# EAGLE schematic prototype_total_schematic_n2 (EAGLE 8.4.1)

## Sheet 1 of 2: Peripherals
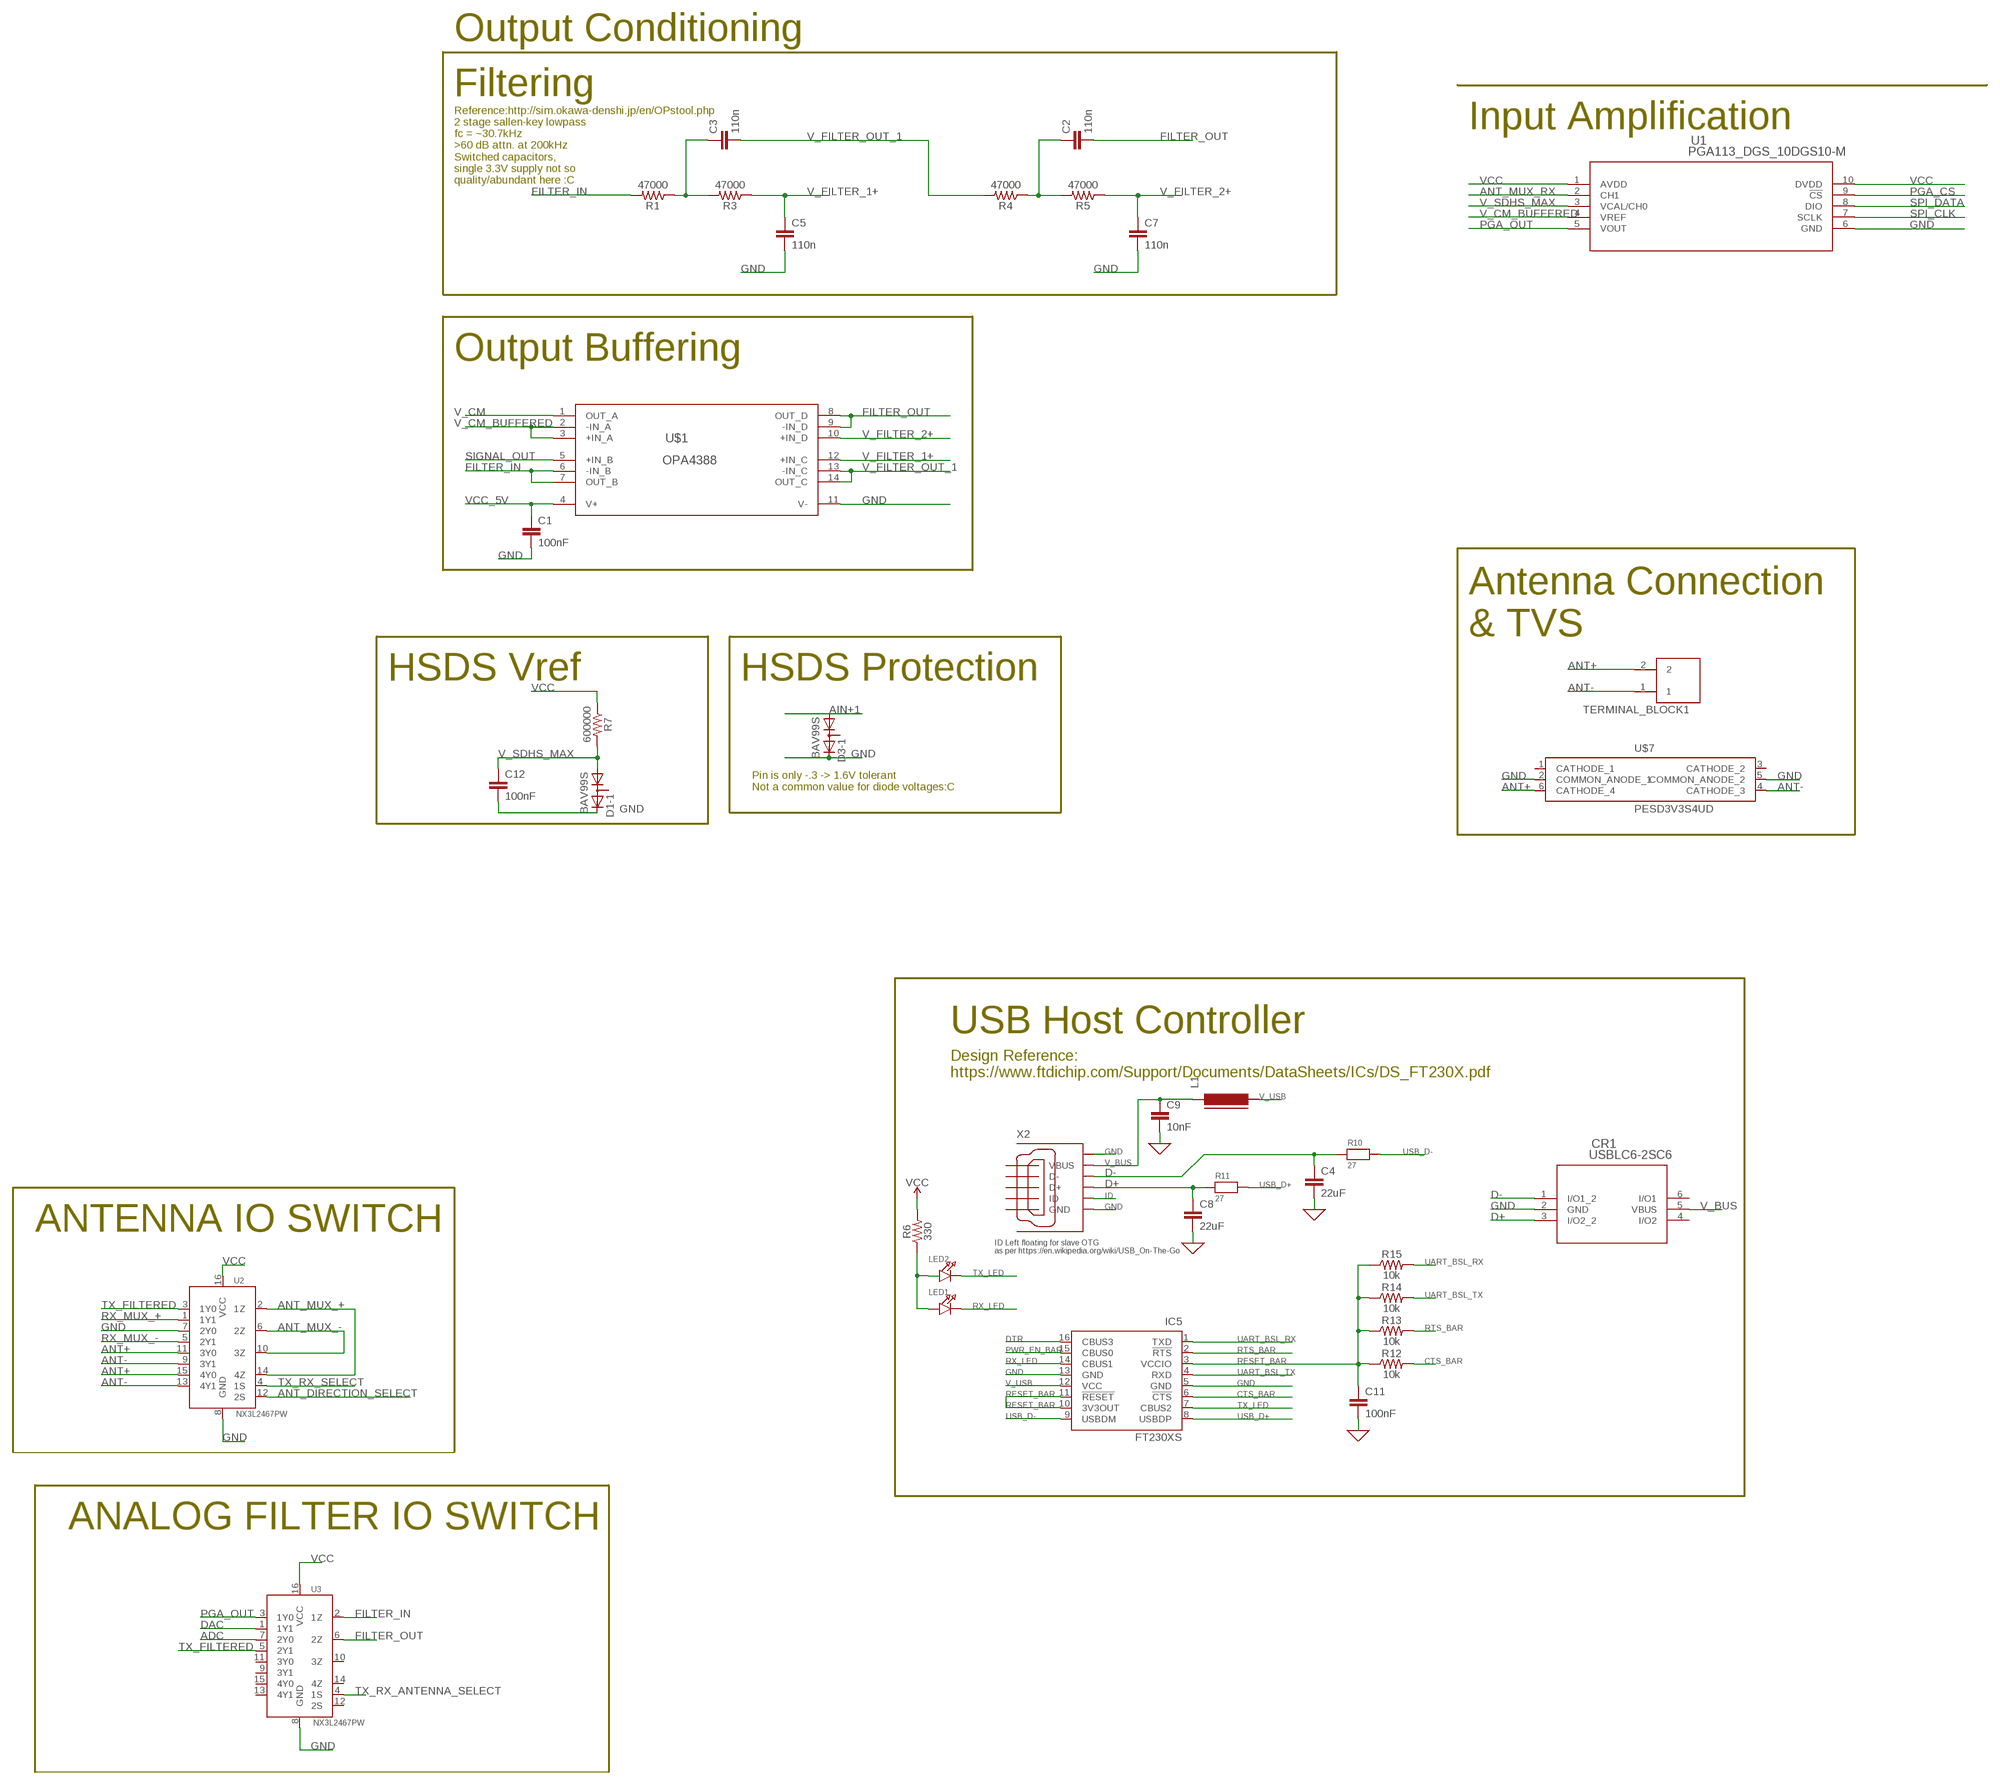
[diagram p0: schematic, sheet 1]

### Parts
C1  100nF  22UF-0805-6.3V-20%  [0805]
C2  110n  22UF-0805-6.3V-20%  [0805]
C3  110n  22UF-0805-6.3V-20%  [0805]
C4  22uF  22UF-0805-6.3V-20%  [0805]
C5  110n  22UF-0805-6.3V-20%  [0805]
C7  110n  22UF-0805-6.3V-20%  [0805]
C8  22uF  22UF-0805-6.3V-20%  [0805]
C9  10nF  22UF-0805-6.3V-20%  [0805]
C11  100nF  22UF-0805-6.3V-20%  [0805]
C12  100nF  22UF-0805-6.3V-20%  [0805]
CR1  USBLC6-2SC6  [SOT23-6L]
D1  BAV99S  [SOT363]
D3  BAV99S  [SOT363]
IC5  FT230XS  [SSOP16]
L1  FERRITE-0805  [FB805]
LED1  LED0805  [CHIPLED_0805]
LED2  LED0805  [CHIPLED_0805]
R1  47000  2.0KOHM-0603-1/10W-5%  [0603]
R3  47000  2.0KOHM-0603-1/10W-5%  [0603]
R4  47000  2.0KOHM-0603-1/10W-5%  [0603]
R5  47000  2.0KOHM-0603-1/10W-5%  [0603]
R6  330  2.0KOHM-0603-1/10W-5%  [0603]
R7  600000  2.0KOHM-0603-1/10W-5%  [0603]
R10  27  RESISTOR0805_NOTHERMALS  [0805_NOTHERMALS]
R11  27  RESISTOR0805_NOTHERMALS  [0805_NOTHERMALS]
R12  10k  2.0KOHM-0603-1/10W-5%  [0603]
R13  10k  2.0KOHM-0603-1/10W-5%  [0603]
R14  10k  2.0KOHM-0603-1/10W-5%  [0603]
R15  10k  2.0KOHM-0603-1/10W-5%  [0603]
TERMINAL_BLOCK1  ED555/2DS  [ED555/2DS]
U1  PGA113_DGS_10DGS10-M  [DGS10-M]
U2  NX3L2467PW  [SOT403-1]
U3  NX3L2467PW  [SOT403-1]
U$1  OPA4388  [TSSOP-14]
U$7  PESD3V3S4UD  [SOT23-6]
X2  GHI-CONNECTORS_10118192-0001LF  [GHI-CONNECTORS_10118192-0001LF(MICRO-USB-B-AMPHENOL-FCI)]

### Nets
0: C4.2 C8.2 C9.2 C11.2 ; supply symbol labelled GND
ADC: U3.7(2Y0)
ANT+: TERMINAL_BLOCK1.2 U2.11(3Y0) U2.15(4Y0) U$7.6(CATHODE_4)
ANT-: TERMINAL_BLOCK1.1 U2.9(3Y1) U2.13(4Y1) U$7.4(CATHODE_3)
ANT_DIRECTION_SELECT: U2.12(2S)
ANT_MUX_+: U2.2(1Z) U2.14(4Z)
ANT_MUX_-: U2.6(2Z) U2.10(3Z)
ANT_MUX_RX: U1.2(CH1)
CTS_BAR: IC5.6(!CTS) R12.2
D+: C8.1 CR1.3(I/O2_2) R11.1 X2.CGND3(SGND3)
D-: C4.1 CR1.1(I/O1_2) R10.1 X2.CGND4(SGND4)
DAC: U3.1(1Y1) ; also sheet 2
DTR: IC5.16(CBUS3) ; also sheet 2
FILTER_IN: R1.2 U3.2(1Z) U$1.6(-IN_B) U$1.7(OUT_B)
FILTER_OUT: C2.2 U3.6(2Z) U$1.8(OUT_D) U$1.9(-IN_D)
GND: C1.2 C5.2 C7.2 C12.2 CR1.2(GND) D1.2(-1:K2) D3.2(-1:K2) IC5.5(GND) IC5.13(GND) U1.6(GND) U2.7(2Y0) U2.8(GND) U3.8(GND) U$1.11(V-) U$7.2(COMMON_ANODE_1) U$7.5(COMMON_ANODE_2) X2.CGND1(SGND1) X2.CGND6(SGND6) ; also sheet 2
ID: X2.CGND2(SGND2)
N$3: LED1.A LED2.A R6.1
N$5: D3.1(-1:A1)
N$7: C3.1 R1.1 R3.2
N$9: C2.1 R4.1 R5.2
PGA_CS: U1.9(!CS)
PGA_OUT: U1.5(VOUT) U3.3(1Y0)
PWR_EN_BAR: IC5.15(CBUS0)
RESET_BAR: C11.1 IC5.3(VCCIO) IC5.10(3V3OUT) IC5.11(!RESET) R12.1 R13.1 R14.1 R15.1
RTS_BAR: IC5.2(!RTS) R13.2 ; also sheet 2
RX_LED: IC5.14(CBUS1) LED1.C ; also sheet 2
RX_MUX_+: U2.1(1Y1)
RX_MUX_-: U2.5(2Y1)
SIGNAL_OUT: U$1.5(+IN_B)
SPI_CLK: U1.7(SCLK)
SPI_DATA: U1.8(DIO)
TX_FILTERED: U2.3(1Y0) U3.5(2Y1)
TX_LED: IC5.7(CBUS2) LED2.C ; also sheet 2
TX_RX_ANTENNA_SELECT: U3.4(1S)
TX_RX_SELECT: U2.4(1S)
UART_BSL_RX: IC5.1(TXD) R15.2 ; also sheet 2
UART_BSL_TX: IC5.4(RXD) R14.2 ; also sheet 2
USB_D+: IC5.8(USBDP) R11.2
USB_D-: IC5.9(USBDM) R10.2
V_BUS: C9.1 CR1.5(VBUS) L1.1 X2.CGND5(SGND5)
V_CM: U$1.1(OUT_A) ; also sheet 2
V_CM_BUFFERED: U1.4(VREF) U$1.2(-IN_A) U$1.3(+IN_A)
V_FILTER_1+: C5.1 R3.1 U$1.12(+IN_C)
V_FILTER_2+: C7.1 R5.1 U$1.10(+IN_D)
V_FILTER_OUT_1: C3.2 R4.2 U$1.13(-IN_C) U$1.14(OUT_C)
V_SDHS_MAX: C12.1 D1.1(-1:A1) R7.2 U1.3(VCAL/CH0)
V_USB: IC5.12(VCC) L1.2
VCC: R6.2 R7.1 U1.1(AVDD) U1.10(DVDD) U2.16(VCC) U3.16(VCC) ; also sheet 2
VCC_5V: C1.1 U$1.4(V+)
Unconnected: CR1.4(I/O2) CR1.6(I/O1) D1.3(-2:K1A2) D1.4(-2:A1) D1.5(-2:K2) D1.6(-1:K1A2) D3.3(-2:K1A2) D3.4(-2:A1) D3.5(-2:K2) D3.6(-1:K1A2) U3.9(3Y1) U3.10(3Z) U3.11(3Y0) U3.12(2S) U3.13(4Y1) U3.14(4Z) U3.15(4Y0) U$7.1(CATHODE_1) U$7.3(CATHODE_2) X2.D+ X2.D- X2.GND X2.ID X2.VBUS

### Notes on the sheet
- Output Conditioning
- Filtering
- Input Amplification
- Reference:http://sim.okawa-denshi.jp/en/OPstool.php
  2 stage sallen-key lowpass
  fc = ~30.7kHz
  >60 dB attn. at 200kHz
  Switched capacitors, 
  single 3.3V supply not so 
  quality/abundant here :C
- Output Buffering
- Antenna Connection 
  & TVS
- HSDS Vref | HSDS Protection
- Pin is only -.3 -> 1.6V tolerant
  Not a common value for diode voltages:C
- USB Host Controller
- Design Reference:
  https://www.ftdichip.com/Support/Documents/DataSheets/ICs/DS_FT230X.pdf
- ANTENNA IO SWITCH
- ID Left floating for slave OTG
  as per https://en.wikipedia.org/wiki/USB_On-The-Go
- ANALOG FILTER IO SWITCH

## Sheet 2 of 2: MCU
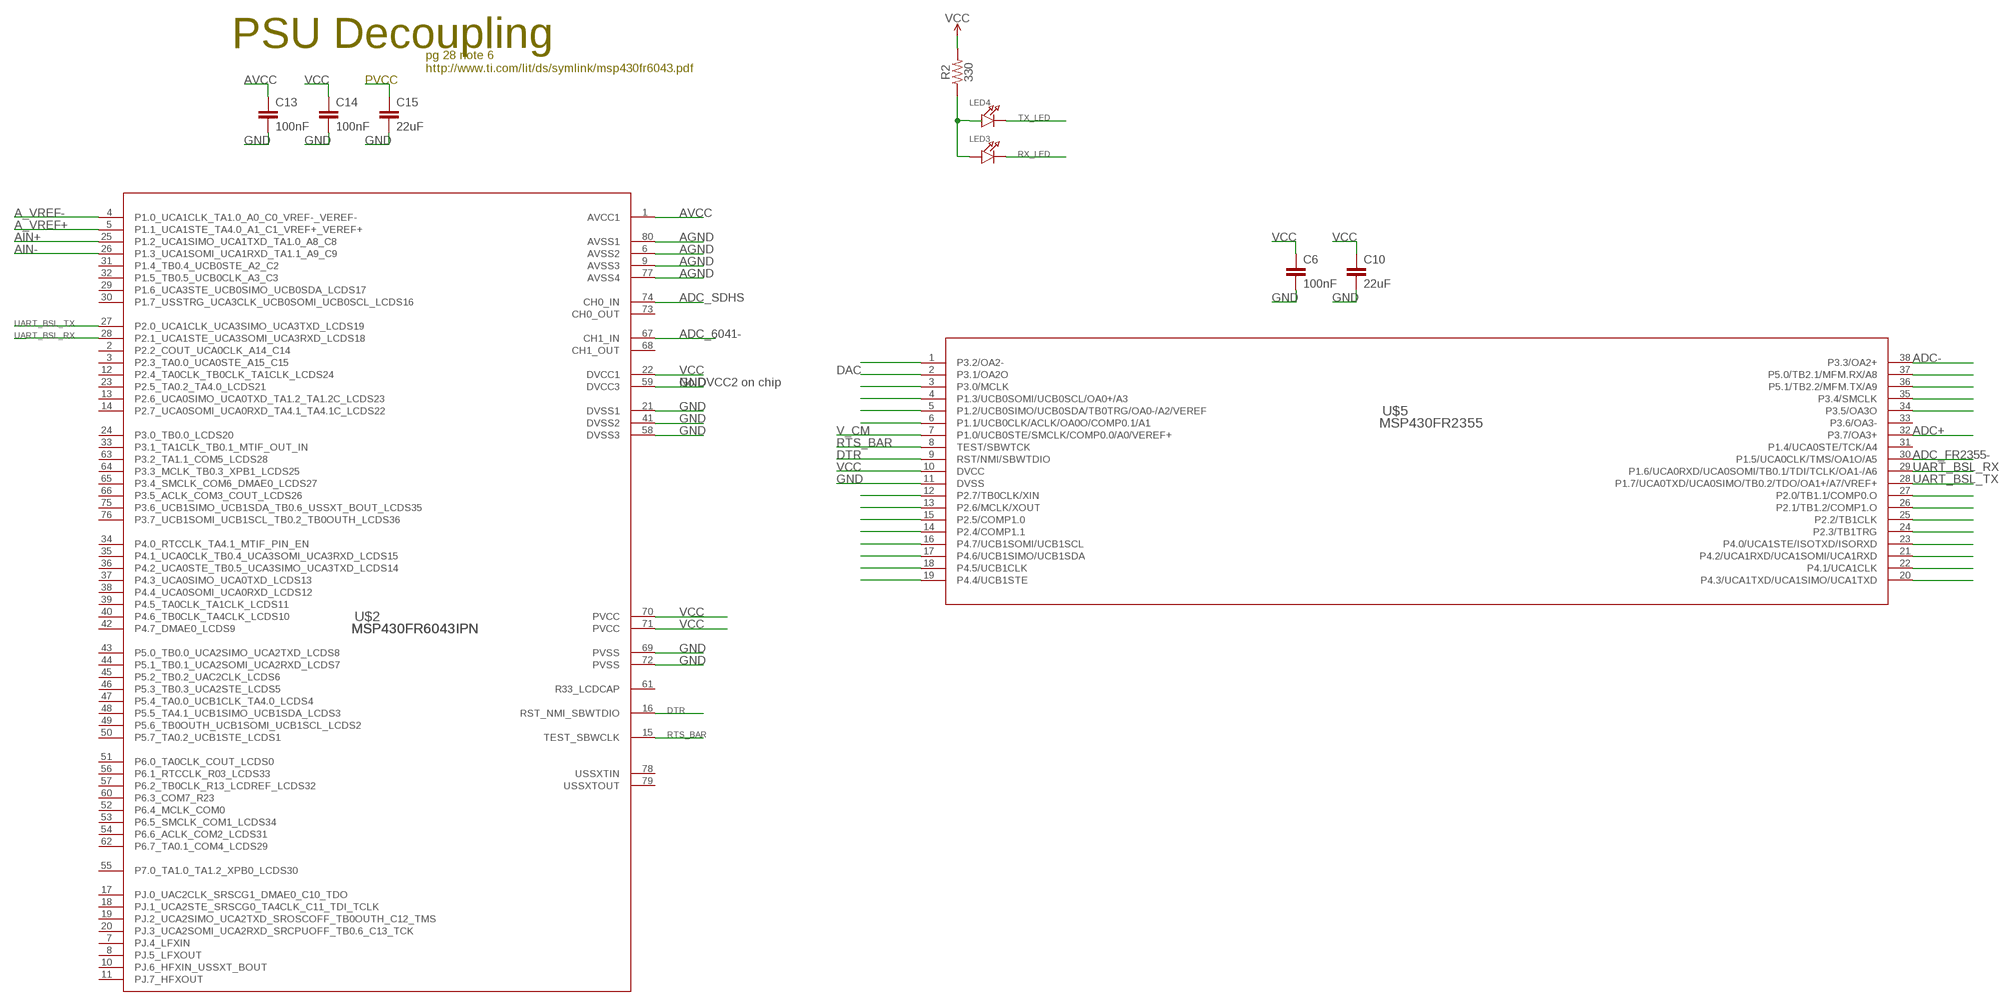
[diagram p1: schematic, sheet 2]

### Parts
C6  100nF  22UF-0805-6.3V-20%  [0805]
C10  22uF  22UF-0805-6.3V-20%  [0805]
C13  100nF  22UF-0805-6.3V-20%  [0805]
C14  100nF  22UF-0805-6.3V-20%  [0805]
C15  22uF  22UF-0805-6.3V-20%  [0805]
LED3  LED0805  [CHIPLED_0805]
LED4  LED0805  [CHIPLED_0805]
R2  330  2.0KOHM-0603-1/10W-5%  [0603]
U$2  MSP430FR6043IPN  [PN0080A_N]
U$5  MSP430FR2355  [DA38]

### Nets
1: U$5.27(P2.0/TB1.1/COMP0.O)
A_VREF+: U$2.5(P1.1_UCA1STE_TA4.0_A1_C1_VREF+_VEREF+)
A_VREF-: U$2.4(P1.0_UCA1CLK_TA1.0_A0_C0_VREF-_VEREF-)
ADC+: U$5.32(P3.7/OA3+)
ADC-: U$5.38(P3.3/OA2+)
ADC_6041-: U$2.67(CH1_IN)
ADC_FR2355-: U$5.30(P1.5/UCA0CLK/TMS/OA1O/A5)
ADC_SDHS: U$2.74(CH0_IN)
AGND: U$2.6(AVSS2) U$2.9(AVSS3) U$2.77(AVSS4) U$2.80(AVSS1)
AIN+: U$2.25(P1.2_UCA1SIMO_UCA1TXD_TA1.0_A8_C8)
AIN-: U$2.26(P1.3_UCA1SOMI_UCA1RXD_TA1.1_A9_C9)
AVCC: C13.1 U$2.1(AVCC1)
DAC: U$5.2(P3.1/OA2O) ; also sheet 1
DTR: U$2.16(RST_NMI_SBWTDIO) U$5.9(RST/NMI/SBWTDIO) ; also sheet 1
GND: C6.2 C10.2 C13.2 C14.2 C15.2 U$2.21(DVSS1) U$2.41(DVSS2) U$2.58(DVSS3) U$2.59(DVCC3) U$2.69(PVSS) U$2.72(PVSS) U$5.11(DVSS) ; also sheet 1
N$2: U$5.20(P4.3/UCA1TXD/UCA1SIMO/UCA1TXD)
N$4: U$5.22(P4.1/UCA1CLK)
N$6: U$5.21(P4.2/UCA1RXD/UCA1SOMI/UCA1RXD)
N$8: U$5.23(P4.0/UCA1STE/ISOTXD/ISORXD)
N$10: U$5.6(P1.1/UCB0CLK/ACLK/OA0O/COMP0.1/A1)
N$11: U$5.5(P1.2/UCB0SIMO/UCB0SDA/TB0TRG/OA0-/A2/VEREF)
N$13: U$5.24(P2.3/TB1TRG)
N$14: U$5.25(P2.2/TB1CLK)
N$16: LED3.A LED4.A R2.1
N$23: U$5.26(P2.1/TB1.2/COMP1.O)
N$31: U$5.34(P3.5/OA3O)
N$32: U$5.35(P3.4/SMCLK)
N$33: U$5.36(P5.1/TB2.2/MFM.TX/A9)
N$34: U$5.37(P5.0/TB2.1/MFM.RX/A8)
N$36: U$5.1(P3.2/OA2-)
N$38: U$5.3(P3.0/MCLK)
N$39: U$5.4(P1.3/UCB0SOMI/UCB0SCL/OA0+/A3)
N$47: U$5.13(P2.6/MCLK/XOUT)
N$48: U$5.12(P2.7/TB0CLK/XIN)
N$49: U$5.14(P2.4/COMP1.1)
N$50: U$5.15(P2.5/COMP1.0)
N$51: U$5.16(P4.7/UCB1SOMI/UCB1SCL)
N$52: U$5.17(P4.6/UCB1SIMO/UCB1SDA)
N$53: U$5.18(P4.5/UCB1CLK)
N$54: U$5.19(P4.4/UCB1STE)
RTS_BAR: U$2.15(TEST_SBWCLK) U$5.8(TEST/SBWTCK) ; also sheet 1
RX_LED: LED3.C ; also sheet 1
TX_LED: LED4.C ; also sheet 1
UART_BSL_RX: U$2.28(P2.1_UCA1STE_UCA3SOMI_UCA3RXD_LCDS18) U$5.29(P1.6/UCA0RXD/UCA0SOMI/TB0.1/TDI/TCLK/OA1-/A6) ; also sheet 1
UART_BSL_TX: U$2.27(P2.0_UCA1CLK_UCA3SIMO_UCA3TXD_LCDS19) U$5.28(P1.7/UCA0TXD/UCA0SIMO/TB0.2/TDO/OA1+/A7/VREF+) ; also sheet 1
V_CM: U$5.7(P1.0/UCB0STE/SMCLK/COMP0.0/A0/VEREF+) ; also sheet 1
VCC: C6.1 C10.1 C14.1 C15.1 R2.2 U$2.22(DVCC1) U$2.70(PVCC) U$2.71(PVCC) U$5.10(DVCC) ; also sheet 1
Unconnected: U$2.2(P2.2_COUT_UCA0CLK_A14_C14) U$2.3(P2.3_TA0.0_UCA0STE_A15_C15) U$2.7(PJ.4_LFXIN) U$2.8(PJ.5_LFXOUT) U$2.10(PJ.6_HFXIN_USSXT_BOUT) U$2.11(PJ.7_HFXOUT) U$2.12(P2.4_TA0CLK_TB0CLK_TA1CLK_LCDS24) U$2.13(P2.6_UCA0SIMO_UCA0TXD_TA1.2_TA1.2C_LCDS23) U$2.14(P2.7_UCA0SOMI_UCA0RXD_TA4.1_TA4.1C_LCDS22) U$2.17(PJ.0_UAC2CLK_SRSCG1_DMAE0_C10_TDO) U$2.18(PJ.1_UCA2STE_SRSCG0_TA4CLK_C11_TDI_TCLK) U$2.19(PJ.2_UCA2SIMO_UCA2TXD_SROSCOFF_TB0OUTH_C12_TMS) U$2.20(PJ.3_UCA2SOMI_UCA2RXD_SRCPUOFF_TB0.6_C13_TCK) U$2.23(P2.5_TA0.2_TA4.0_LCDS21) U$2.24(P3.0_TB0.0_LCDS20) U$2.29(P1.6_UCA3STE_UCB0SIMO_UCB0SDA_LCDS17) U$2.30(P1.7_USSTRG_UCA3CLK_UCB0SOMI_UCB0SCL_LCDS16) U$2.31(P1.4_TB0.4_UCB0STE_A2_C2) U$2.32(P1.5_TB0.5_UCB0CLK_A3_C3) U$2.33(P3.1_TA1CLK_TB0.1_MTIF_OUT_IN) U$2.34(P4.0_RTCCLK_TA4.1_MTIF_PIN_EN) U$2.35(P4.1_UCA0CLK_TB0.4_UCA3SOMI_UCA3RXD_LCDS15) U$2.36(P4.2_UCA0STE_TB0.5_UCA3SIMO_UCA3TXD_LCDS14) U$2.37(P4.3_UCA0SIMO_UCA0TXD_LCDS13) U$2.38(P4.4_UCA0SOMI_UCA0RXD_LCDS12) U$2.39(P4.5_TA0CLK_TA1CLK_LCDS11) U$2.40(P4.6_TB0CLK_TA4CLK_LCDS10) U$2.42(P4.7_DMAE0_LCDS9) U$2.43(P5.0_TB0.0_UCA2SIMO_UCA2TXD_LCDS8) U$2.44(P5.1_TB0.1_UCA2SOMI_UCA2RXD_LCDS7) U$2.45(P5.2_TB0.2_UAC2CLK_LCDS6) U$2.46(P5.3_TB0.3_UCA2STE_LCDS5) U$2.47(P5.4_TA0.0_UCB1CLK_TA4.0_LCDS4) U$2.48(P5.5_TA4.1_UCB1SIMO_UCB1SDA_LCDS3) U$2.49(P5.6_TB0OUTH_UCB1SOMI_UCB1SCL_LCDS2) U$2.50(P5.7_TA0.2_UCB1STE_LCDS1) U$2.51(P6.0_TA0CLK_COUT_LCDS0) U$2.52(P6.4_MCLK_COM0) U$2.53(P6.5_SMCLK_COM1_LCDS34) U$2.54(P6.6_ACLK_COM2_LCDS31) U$2.55(P7.0_TA1.0_TA1.2_XPB0_LCDS30) U$2.56(P6.1_RTCCLK_R03_LCDS33) U$2.57(P6.2_TB0CLK_R13_LCDREF_LCDS32) U$2.60(P6.3_COM7_R23) U$2.61(R33_LCDCAP) U$2.62(P6.7_TA0.1_COM4_LCDS29) U$2.63(P3.2_TA1.1_COM5_LCDS28) U$2.64(P3.3_MCLK_TB0.3_XPB1_LCDS25) U$2.65(P3.4_SMCLK_COM6_DMAE0_LCDS27) U$2.66(P3.5_ACLK_COM3_COUT_LCDS26) U$2.75(P3.6_UCB1SIMO_UCB1SDA_TB0.6_USSXT_BOUT_LCDS35) U$2.76(P3.7_UCB1SOMI_UCB1SCL_TB0.2_TB0OUTH_LCDS36) U$5.31(P1.4/UCA0STE/TCK/A4)

### Notes on the sheet
- PSU Decoupling
- pg 28 note 6
  http://www.ti.com/lit/ds/symlink/msp430fr6043.pdf
- PVCC

## Power pins joined to a net without a drawn wire
CH0_OUT: U$2.73(CH0_OUT)
CH1_OUT: U$2.68(CH1_OUT)
P3.6/OA3-: U$5.33(P3.6/OA3-)
USSXTIN: U$2.78(USSXTIN)
USSXTOUT: U$2.79(USSXTOUT)

## Library data of the parts
C1-C3 C5-C7 C9 C11-C14 = SparkFun-Capacitors:22UF: 22µF ceramic capacitors A capacitor is a passive two-terminal electrical component used to store electrical energy temporarily in an electric field.; PROD_ID: CAP-08402; VALUE: 22uF
C4 C8 C10 C15 = SparkFun-Capacitors:22UF: 22µF ceramic capacitors A capacitor is a passive two-terminal electrical component used to store electrical energy temporarily in an electric field.; PROD_ID: CAP-08402
CR1 = TTE:USBLC6-2SC6; MANUFACTURER_PART_NUMBER: USBLC62SC6; VENDOR: STMicroelectronics
D1 D3 = TTE:BAV99S: High-speed switching diode High-speed switching diodes, encapsulated in small Surface-Mounted Device (SMD) plastic packages. AAL Eindhoven MK; AVAILABILITY: Unavailable; DESCRIPTION: Diode array [NXP] BAV99S Diode array; MF: NXP Semiconductors; MP: BAV99S; PACKAGE: None; PRICE: None
IC5 = ftdi:FT230X: USB to BASIC UART IC Auto generated by make-symbol-device-package-bsdl.ulp Rev. 43 Source: Data sheet <http://www.ftdichip.com/Support/Documents/DataSheets/ICs/DS_FT230X.pdf>
L1 = dp_devices:FERRITE: Ferrite bead in various packages
LED1-LED4 = microbuilder:LED: LED 0603 - 0603 Surface Mount Package 2mA: Green LED - Low Power (3.9mcd, 2ma, 1.7Vf) - Digikey: 475-2709-2-ND Orange LED - Low Power (9.8mcd, 2ma, 1.8Vf) - Digikey: 475-1194-2-ND Red LED - Low Power (5mcd, 2ma, 1.8Vf) - Digikey: 475-1195-2-ND Yellow LED - Low Power (7mcd, 2ma, 1.8Vf) - Digikey: 475-1196-2-ND 5mA: Blue LED - Low Power (17mcd, 5ma, 2.9Vf) - Digikey: LNJ937W8CRACT-ND 0805 - 0805 Surface Mount Package 2mA: Red LED (8.8mcd, 2mA, 1.8Vf, Clear) - Low Power [Digikey: 475-2510-1-ND] Green LED (5mcd, 2mA, 1.8Vf, Clear) - Low Power [Digikey: 475-2730-1-ND] Yellow LED (11.3mcd, 2mA, 1.8Vf, Clear) - Low Power [Digikey: 475-2555-1-ND] 20mA: Red LED (104mcd, 20mA, Diffused) - LS R976 [Digikey: 475-1278-6-ND] Red LED (12mcd, 20mA, 2.0Vf, Clear) - APT2012EC [Digikey: 754-1128-1-ND] Green LED (15mcd, 20mA, 2.2Vf, Clear) - APT2012GC [Digikey: 754-1131-1-ND] Orange LED (160mcd, 20mA, 2.1Vf, Clear) - APT2012SECK [Digikey: 754-1130-1-ND] 1206 - 1206 Surface Mount Package Green LED (26mcd, 20mA, Diffused) - LG N971 [Digikey: 475-1407-6-ND] Red LED (15mcd, 20mA, Diffused) - LH N974 [Digikey: 475-1416-6-ND]
R1-R7 R12-R15 = SparkFun-Resistors:2.0KOHM: 2kΩ resistor A resistor is a passive two-terminal electrical component that implements electrical resistance as a circuit element. Resistors act to reduce current flow, and, at the same time, act to lower voltage levels within circuits. - Wikipedia; PROD_ID: RES-08296; VALUE: 2.0k
R10 R11 = microbuilder:RESISTOR: Resistors 0402 - 0402 Surface Mount Package 22 Ohm 1% 1/16W [Digikey: 311-22.0LRTR-ND] 33 Ohm 5% 1/16W 1.0K 5% 1/16W 1.5K 5% 1/16W 2.0K 1% 1/16W 10.0K 1% 1/16W [Digikey: 311-10.0KLRTR-ND] 10.0K 5% 1/16W [Digikey: RMCF0402JT10K0TR-ND] 12.1K 1% 1/16W [Digikey: 311-22.0LRTR-ND] 100.0K 5% 1/16W 0603 - 0603 Surface Mount Package 0 Ohm 1/10 Watt 1% Resistor 15 Ohm 1/10 Watt 1% Resistor 33 Ohm 1/10 Watt 1% Resistor 49.9 Ohm 1/10 Watt 1% Resistor 100 Ohm 1/10 Watt 1% Resistor 150 Ohm 1/10 Watt 1% Resistor 240 Ohm 1/10 Watt 1% Resistor 390 Ohm 1/10 Watt 1% Resistor 560 Ohm 1/10 Watt 1% Resistor 680 Ohm 1/10 Watt 1% Resistor 750 Ohm 1/10 Watt 1% Resistor 1.0K Ohm 1/10 Watt 1% Resistor 1.5K Ohm 1/10 Watt 1% Resistor 2.0K Ohm 1/10 Watt 1% Resistor 2.2K Ohm 1/10 Watt 1% Resistor 3.3K Ohm 1/10 Watt 1% Resistor 4.7K Ohm 1/10 Watt 1% Resistor 10.0K Ohm 1/10 Watt 1% Resistor 12.0K Ohm 1/10 Watt 1% Resistor 12.1K Ohm 1/10 Watt 1% Resistor 20.0K Ohm 1/10 Watt 1% Resistor 33.0K Ohm 1/10 Watt 1% Resistor 100.0K Ohm 1/10 Watt 1% Resistor 0805 - 0805 Surface Mount Package 0 Ohm 1/8 Watt 1% Resistor 33 Ohm 1/8 Watt 1% Resistor 100 Ohm 1/8 Watt 1% Resistor 150 Ohm 1/8 Watt 1% Resistor 200 Ohm 1/8 Watt 1% Resistor 240 Ohm 1/8 Watt 1% Resistor 330 Ohm 1/8 Watt 1% Resistor 390 Ohm 1/8 Watt 1% Resistor 470 Ohm 1/8 Watt 1% Resistor 1.0K Ohm 1/8 Watt 1% Resistor 1.5K Ohm 1/8 Watt 1% Resistor 2.0K Ohm 1/8 Watt 1% Resistor 4.7K Ohm 1/8 Watt 1% Resistor 5.1K Ohm 1/8 Watt 1% Resistor 5.6K Ohm 1/8 Watt 1% Resistor 10.0K Ohm 1/8 Watt 1% Resistor 22.0K Ohm 1/8 Watt 1% Resistor 33.0K Ohm 1/8 Watt 1% Resistor 100K Ohm 1/8 Watt 1% Resistor 1206 - 1206 Surface Mount Package 2012 - 2010 Surface Mount Package 0.11 Ohm 1/2 Watt 1% Resistor - Digikey: RHM.11UCT-ND
TERMINAL_BLOCK1 = DC_LOAD_AU:ED555/2DS: 2-Pin Terminal Block 3.5mm pitch 6A
U1 = TTE:PGA113_DGS_10; MANUFACTURER_PART_NUMBER: PGA113_DGS_10; VENDOR: Texas Instruments
U2 U3 = TTE:NX3L2467: The NX3L2467 is a dual low-ohmic double-pole double-throw analog switch suitable for use as an analog or digital multiplexer/demultiplexer. It consists of four switches, each with two independent input/outputs (nY0 and nY1) and a common input/output (nZ). The two digital inputs (1S and 2S) are used to select the switch position. 1S is used in selecting the independent inputs/outputs switched to 1Z and 2Z, and 2S is used in selecting the independent inputs/outputs switched to 3Z and 4Z. Schmitt trigger action at the select input (nS) makes the circuit tolerant to slower input rise and fall times across the entire VCC range from 1.4 V to 4.3 V. AAL Eindhoven MK
U$1 = TTE:OPA4388
U$2 = TTE:MSP430FR6043IPN
U$5 = TTE:MSP430FR2355
U$7 = TTE:PESD3V3S4UD
X2 = BeagleBone_Black_Wireless:GHI-CONNECTORS_10118192-0001LF: Amphenol FCI Micro USB Type B Complete Surface Mount (SMT) no guide holes